# EAGLE design LED-Platinen (EAGLE 6.5.0)
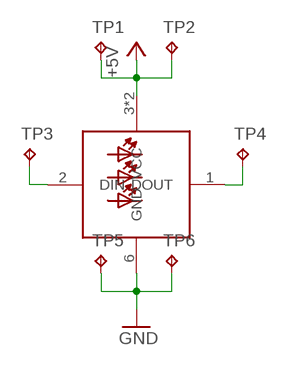
[diagram p0: schematic, sheet 1]

## Parts
TP1  TPTP15SQ  [TP15SQ]
TP2  TPTP15SQ  [TP15SQ]
TP3  TPTP15SQ  [TP15SQ]
TP4  TPTP15SQ  [TP15SQ]
TP5  TPTP15SQ  [TP15SQ]
TP6  TPTP15SQ  [TP15SQ]
U$1  RGBLED  [RGBLED]

## Nets
+5V: TP1.TP TP2.TP U$1.3(VCC) U$1.5(VCC)
N$1: TP4.TP U$1.1(DOUT)
N$2: TP3.TP U$1.2(DIN)
RM: TP5.TP TP6.TP U$1.6(GND) ; supply symbol labelled GND

## Library data of the parts
TP1-TP6 = testpad:TP: Test pad
U$1 = rgbled:RGBLED

## Board
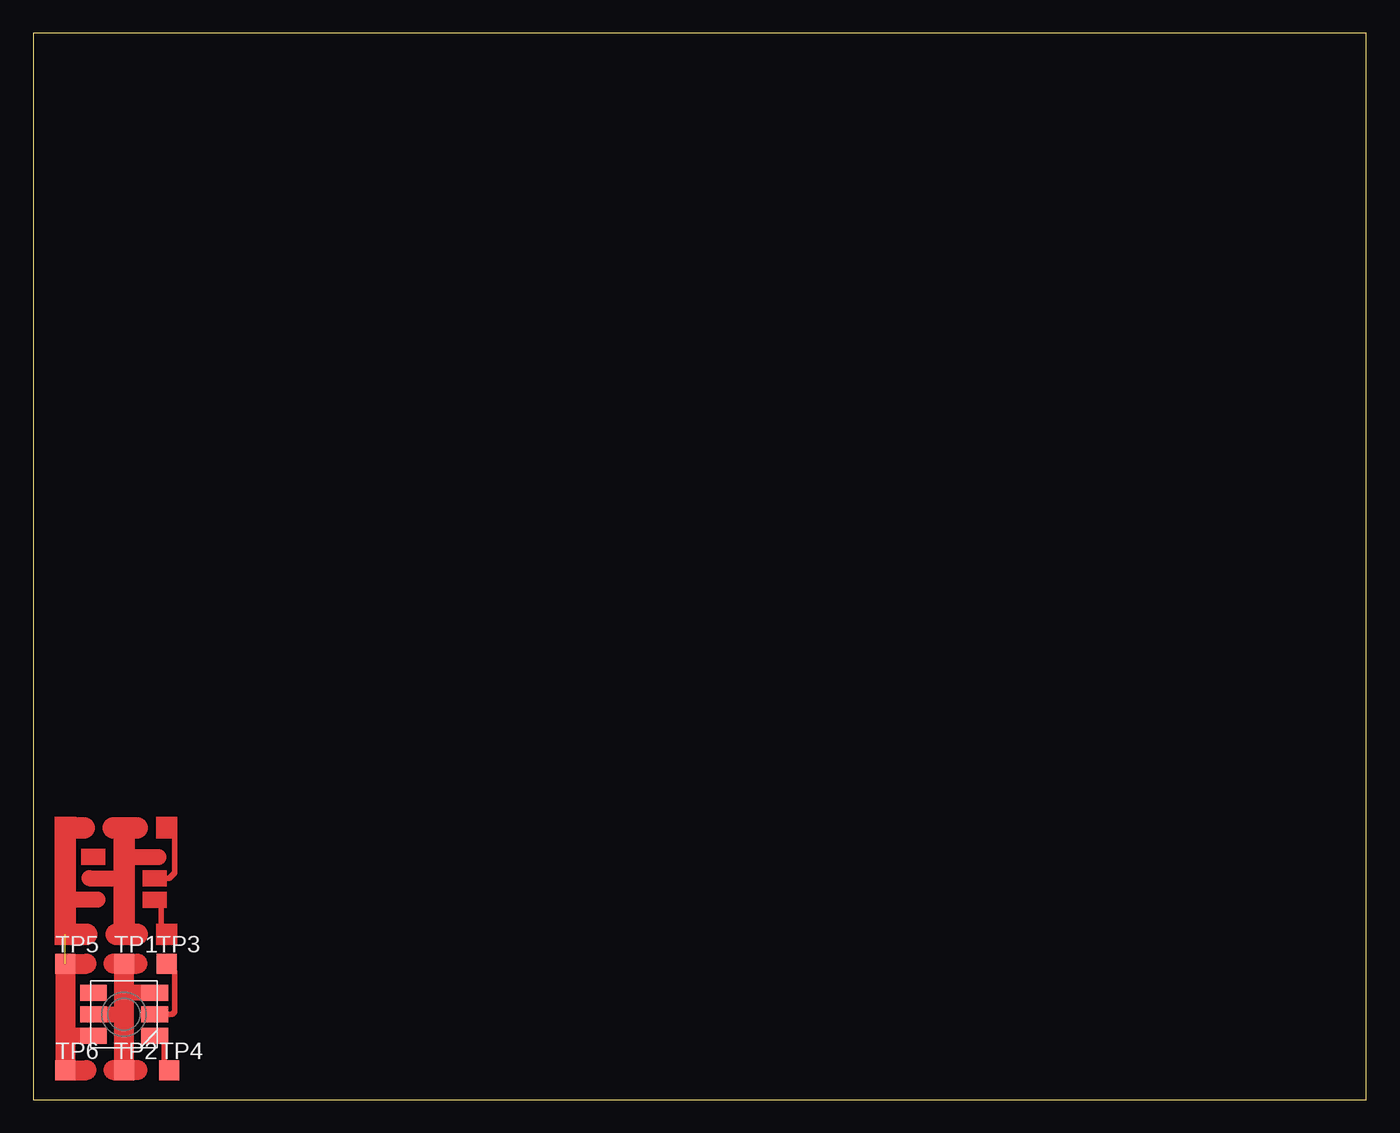
[diagram p1: board, top side]

Size 100 x 80 mm. Coordinates in mm from the lower left corner, seen from the top.
Outline: 0,0 100,0 100,80 0,80 0,0
Copper layers (1*16): Top 0.035mm / dielectric 1.6mm / Bottom 0.035mm
Design rules "default": minimum track width 0.2mm, minimum drill 0.4mm, track to track 0.2mm, track to pad 0.2mm, pad to pad 0.2mm, via to via 0.2mm, smd to smd 0mil, copper to edge 0.2mm, drill to drill 0.2mm, minimum pad ring 0.25mm, minimum via ring 0.2mm, stop-mask expansion 4mil, vias tented up to drill 0.5mm, thermal gap 10mil

### Footprints (pad centres in the part's own frame; a part is rotated, then mirrored left to right if it is on the bottom)
TP15SQ = smd 1.5 x 1.5: TP 0,0
RGBLED = smd 2 x 1.2: 1 2.3,-1.6; 2 2.3,0; 3 2.3,1.6; 4 -2.3,1.6; 5 -2.3,0; 6 -2.3,-1.6

### Placement (x,y rotation side)
TP1  6.8,10.2 0 top
TP2  6.8,2.2 0 top
TP3  10,10.2 0 top
TP4  10.2,2.2 0 top
TP5  2.4,10.2 0 top
TP6  2.4,2.2 0 top
U$1  6.8,6.4 0 top

### Tracks (layer width: path | path; a pad name or v marks a point on that pad's centre or on a via)
+5V
  Top 1.2: U$1.3 6.8,8 | U$1.5 6.8,6.4
  Top 1.5: TP2.TP 6.8,6.4 6.8,8 TP1.TP | TP1.TP 7.8,10.2 | TP1.TP 6,10.2 | 7.8,2.2 TP2.TP | 6,2.2 TP2.TP
N$1
  Top 0.4: U$1.1 9.5,4.4 9.8,4.4 9.8,2.6 TP4.TP
N$2
  Top 0.4: U$1.2 10.4,6.4 10.6,6.6 10.6,9.6 TP3.TP
N$3
  Top 1.2: 4.2,16.6 7,16.6 | 6.6,18.2 9.4,18.2
N$4
  Top 1.6: 6.8,20.4 6.8,12.4
N$5
  Top 1.6: 6,20.4 7.8,20.4
N$6
  Top 0.4: 9.6,16.6 10.2,16.6 10.6,17 10.6,19.8
N$7
  Top 0.4: 9.6,14.8 9.6,12.8
N$8
  Top 1.6: 6.2,12.4 7.8,12.4
RM  (1 unrouted)
  Top 1.2: U$1.6 2.6,4.8 2.4,5 | 4.8,15 2.4,15
  Top 1.5: 4,10.2 TP5.TP 2.4,5 TP6.TP 4,2.2
  Top 1.6: 4,12.4 2.4,12.4 2.4,15 2.4,20.4 3.8,20.4
(copper drawn outside any net)
  shapes: Top area x7